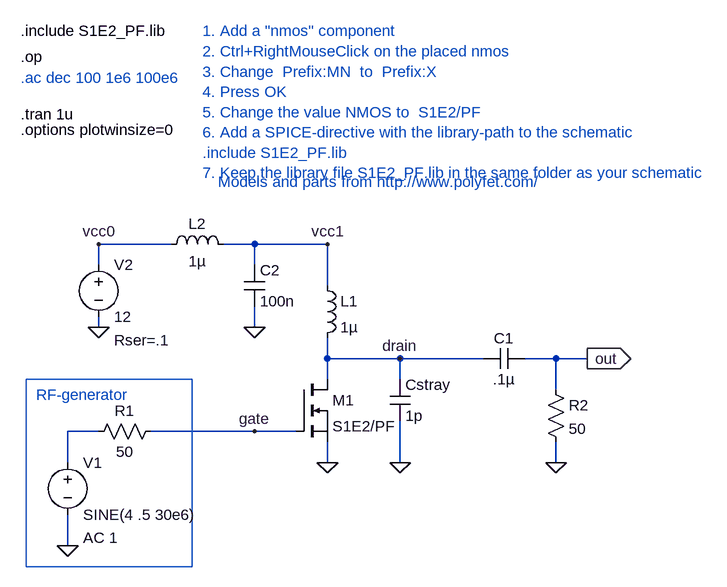
[diagram p0: schematic S1E2_test.asc]
S1E2_test.asc, the LTspice schematic file:
Version 4
SHEET 1 1088 680
WIRE -288 304 -288 256
WIRE -288 432 -288 384
WIRE -240 0 -240 -32
WIRE -240 96 -240 80
WIRE -240 256 -288 256
WIRE -128 -32 -240 -32
WIRE 0 -32 -48 -32
WIRE 0 0 0 -32
WIRE 0 96 0 64
WIRE 0 256 -160 256
WIRE 64 256 0 256
WIRE 112 -32 0 -32
WIRE 112 32 112 -32
WIRE 112 144 112 112
WIRE 112 176 112 144
WIRE 112 304 112 272
WIRE 224 144 112 144
WIRE 224 176 224 144
WIRE 224 304 224 240
WIRE 352 144 224 144
WIRE 464 144 416 144
WIRE 464 192 464 144
WIRE 464 304 464 272
WIRE 512 144 464 144
FLAG 112 304 0
FLAG -288 432 0
FLAG 464 304 0
FLAG -240 96 0
FLAG 0 96 0
FLAG 224 304 0
FLAG 512 144 out
IOPIN 512 144 Out
FLAG 224 144 drain
FLAG 0 256 gate
FLAG 112 -32 vcc1
FLAG -240 -32 vcc0
SYMBOL nmos 64 176 R0
SYMATTR InstName M1
SYMATTR Value S1E2/PF
SYMATTR Prefix X
SYMBOL ind 96 16 R0
SYMATTR InstName L1
SYMATTR Value 1µ
SYMATTR SpiceLine Rser=.1 Rpar=1e3 Cpar=1p
SYMBOL res -256 272 R270
WINDOW 0 32 56 VTop 0
WINDOW 3 0 56 VBottom 0
SYMATTR InstName R1
SYMATTR Value 50
SYMBOL voltage -288 288 R0
WINDOW 123 24 132 Left 0
WINDOW 39 0 0 Left 0
SYMATTR InstName V1
SYMATTR Value SINE(4 .5 30e6)
SYMATTR Value2 AC 1
SYMBOL cap 352 160 R270
WINDOW 0 32 32 VTop 0
WINDOW 3 0 32 VBottom 0
SYMATTR InstName C1
SYMATTR Value .1µ
SYMBOL res 448 176 R0
SYMATTR InstName R2
SYMATTR Value 50
SYMBOL voltage -240 -16 R0
WINDOW 123 0 0 Left 0
WINDOW 39 24 132 Left 0
SYMATTR InstName V2
SYMATTR Value 12
SYMATTR SpiceLine Rser=.1
SYMBOL cap -16 0 R0
SYMATTR InstName C2
SYMATTR Value 100n
SYMATTR SpiceLine Rser=0.02 Lser= 2n
SYMBOL cap 208 176 R0
SYMATTR InstName Cstray
SYMATTR Value 1p
SYMBOL ind -144 -16 R270
WINDOW 0 32 56 VTop 0
WINDOW 3 5 56 VBottom 0
SYMATTR InstName L2
SYMATTR Value 1µ
SYMATTR SpiceLine Rser=0.05 Rpar=1k
TEXT -360 -288 Left 0 ;.ac dec 100 1e6 100e6
TEXT -360 -232 Left 0 !.tran 1u
TEXT -360 -208 Left 0 !.options plotwinsize=0
TEXT -360 -320 Left 0 !.op
TEXT -360 -360 Left 0 !.include S1E2_PF.lib
TEXT -56 -128 Left 0 ;Models and parts from http://www.polyfet.com/
TEXT -80 -360 Left 0 ;1. Add a "nmos" component \n2. Ctrl+RightMouseClick on the placed nmos\n3. Change  Prefix:MN  to  Prefix:X\n4. Press OK\n5. Change the value NMOS to  S1E2/PF\n6. Add a SPICE-directive with the library-path to the schematic  \n.include S1E2_PF.lib\n7. Keep the library file S1E2_PF.lib in the same folder as your schematic
TEXT -336 200 Left 0 ;RF-generator
RECTANGLE Normal -96 464 -352 176

The netlist it stands for:
* S1E2_test.asc
XM1 drain gate 0 S1E2/PF  ; pins D G S
L1 vcc1 drain 1µ Rser=.1 Rpar=1e3 Cpar=1p
R1 N001 gate 50
V1 N001 0 SINE(4 .5 30e6) AC 1
C1 drain out .1µ
R2 out 0 50
V2 vcc0 0 12 Rser=.1
C2 vcc1 0 100n Rser=0.02 Lser= 2n
Cstray drain 0 1p
L2 vcc0 vcc1 1µ Rser=0.05 Rpar=1k
* .ac dec 100 1e6 100e6
.tran 1u
.options plotwinsize=0
.op
.include S1E2_PF.lib
* Models and parts from http://www.polyfet.com/
* 1. Add a "nmos" component
* 2. Ctrl+RightMouseClick on the placed nmos
* 3. Change  Prefix:MN  to  Prefix:X
* 4. Press OK
* 5. Change the value NMOS to  S1E2/PF
* 6. Add a SPICE-directive with the library-path to the schematic
* .include S1E2_PF.lib
* 7. Keep the library file S1E2_PF.lib in the same folder as your schematic
* RF-generator
.backanno
.end